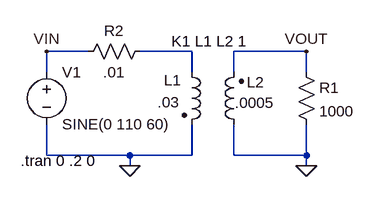
[diagram p0: schematic Transformer.asc]
Transformer.asc, the LTspice schematic file:
Version 4
SHEET 1 880 680
WIRE 48 48 -16 48
WIRE 208 48 128 48
WIRE 384 48 272 48
WIRE -16 80 -16 48
WIRE 208 80 208 48
WIRE 272 80 272 48
WIRE 384 80 384 48
WIRE -16 208 -16 160
WIRE 112 208 -16 208
WIRE 208 208 208 160
WIRE 208 208 112 208
WIRE 272 208 272 160
WIRE 384 208 384 160
WIRE 384 208 272 208
WIRE 112 224 112 208
WIRE 384 224 384 208
FLAG 384 48 VOUT
FLAG -16 48 VIN
FLAG 384 224 0
FLAG 112 224 0
SYMBOL ind2 192 64 R0
WINDOW 0 -27 28 Left 0
WINDOW 3 -37 62 Left 0
SYMATTR InstName L1
SYMATTR Value .03
SYMATTR Type ind
SYMBOL voltage -16 64 R0
WINDOW 123 0 0 Left 0
WINDOW 39 0 0 Left 0
SYMATTR InstName V1
SYMATTR Value SINE(0 110 60)
SYMBOL res 368 64 R0
SYMATTR InstName R1
SYMATTR Value 1000
SYMBOL res 144 32 R90
WINDOW 0 0 56 VBottom 0
WINDOW 3 32 56 VTop 0
SYMATTR InstName R2
SYMATTR Value .01
SYMBOL ind2 288 176 R180
WINDOW 0 -31 81 Left 0
WINDOW 3 -47 49 Left 0
SYMATTR InstName L2
SYMATTR Value .0005
SYMATTR Type ind
TEXT -56 216 Left 0 !.tran 0 .2 0
TEXT 176 32 Left 0 !K1 L1 L2 1

The netlist it stands for:
* Transformer.asc
L1 N001 0 .03
V1 VIN 0 SINE(0 110 60)
R1 VOUT 0 1000
R2 N001 VIN .01
L2 0 VOUT .0005
.tran 0 .2 0
K1 L1 L2 1
.backanno
.end

* Results of the author's LTspice run, read from the files saved beside the schematic
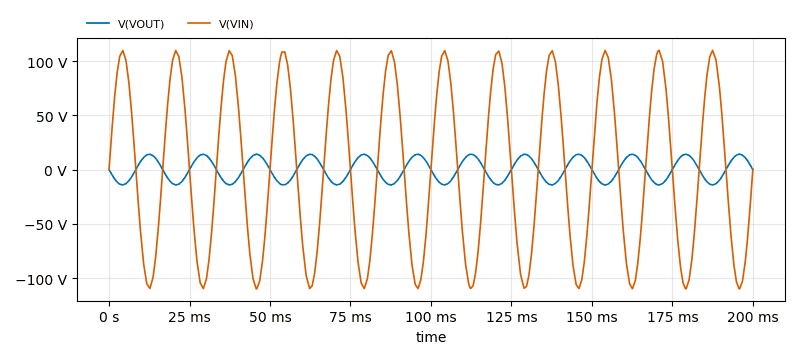
[diagram p1: Transient Analysis of Transformer.asc, plotted from the saved traces]
* Transient Analysis, 1 run:
*   V(VOUT): min -14.17 V, max 14.19 V, average 13.75 mV, rms 9.999 V, last -809.4 µV
*   V(VIN): min -109.8 V, max 109.9 V, average -12.54 mV, rms 77.45 V, last 0 V